# EasyEDA Pro project imu.eprj

# Schematic Schematic
Board Name: Board1; Create Date: 2025-12-13; Page Name: main; Project Name: imu; Schematic Name: Schematic; Update Date: 2025-12-13; Company: EasyEDA.com; Page Size: A4; Version: V1.0
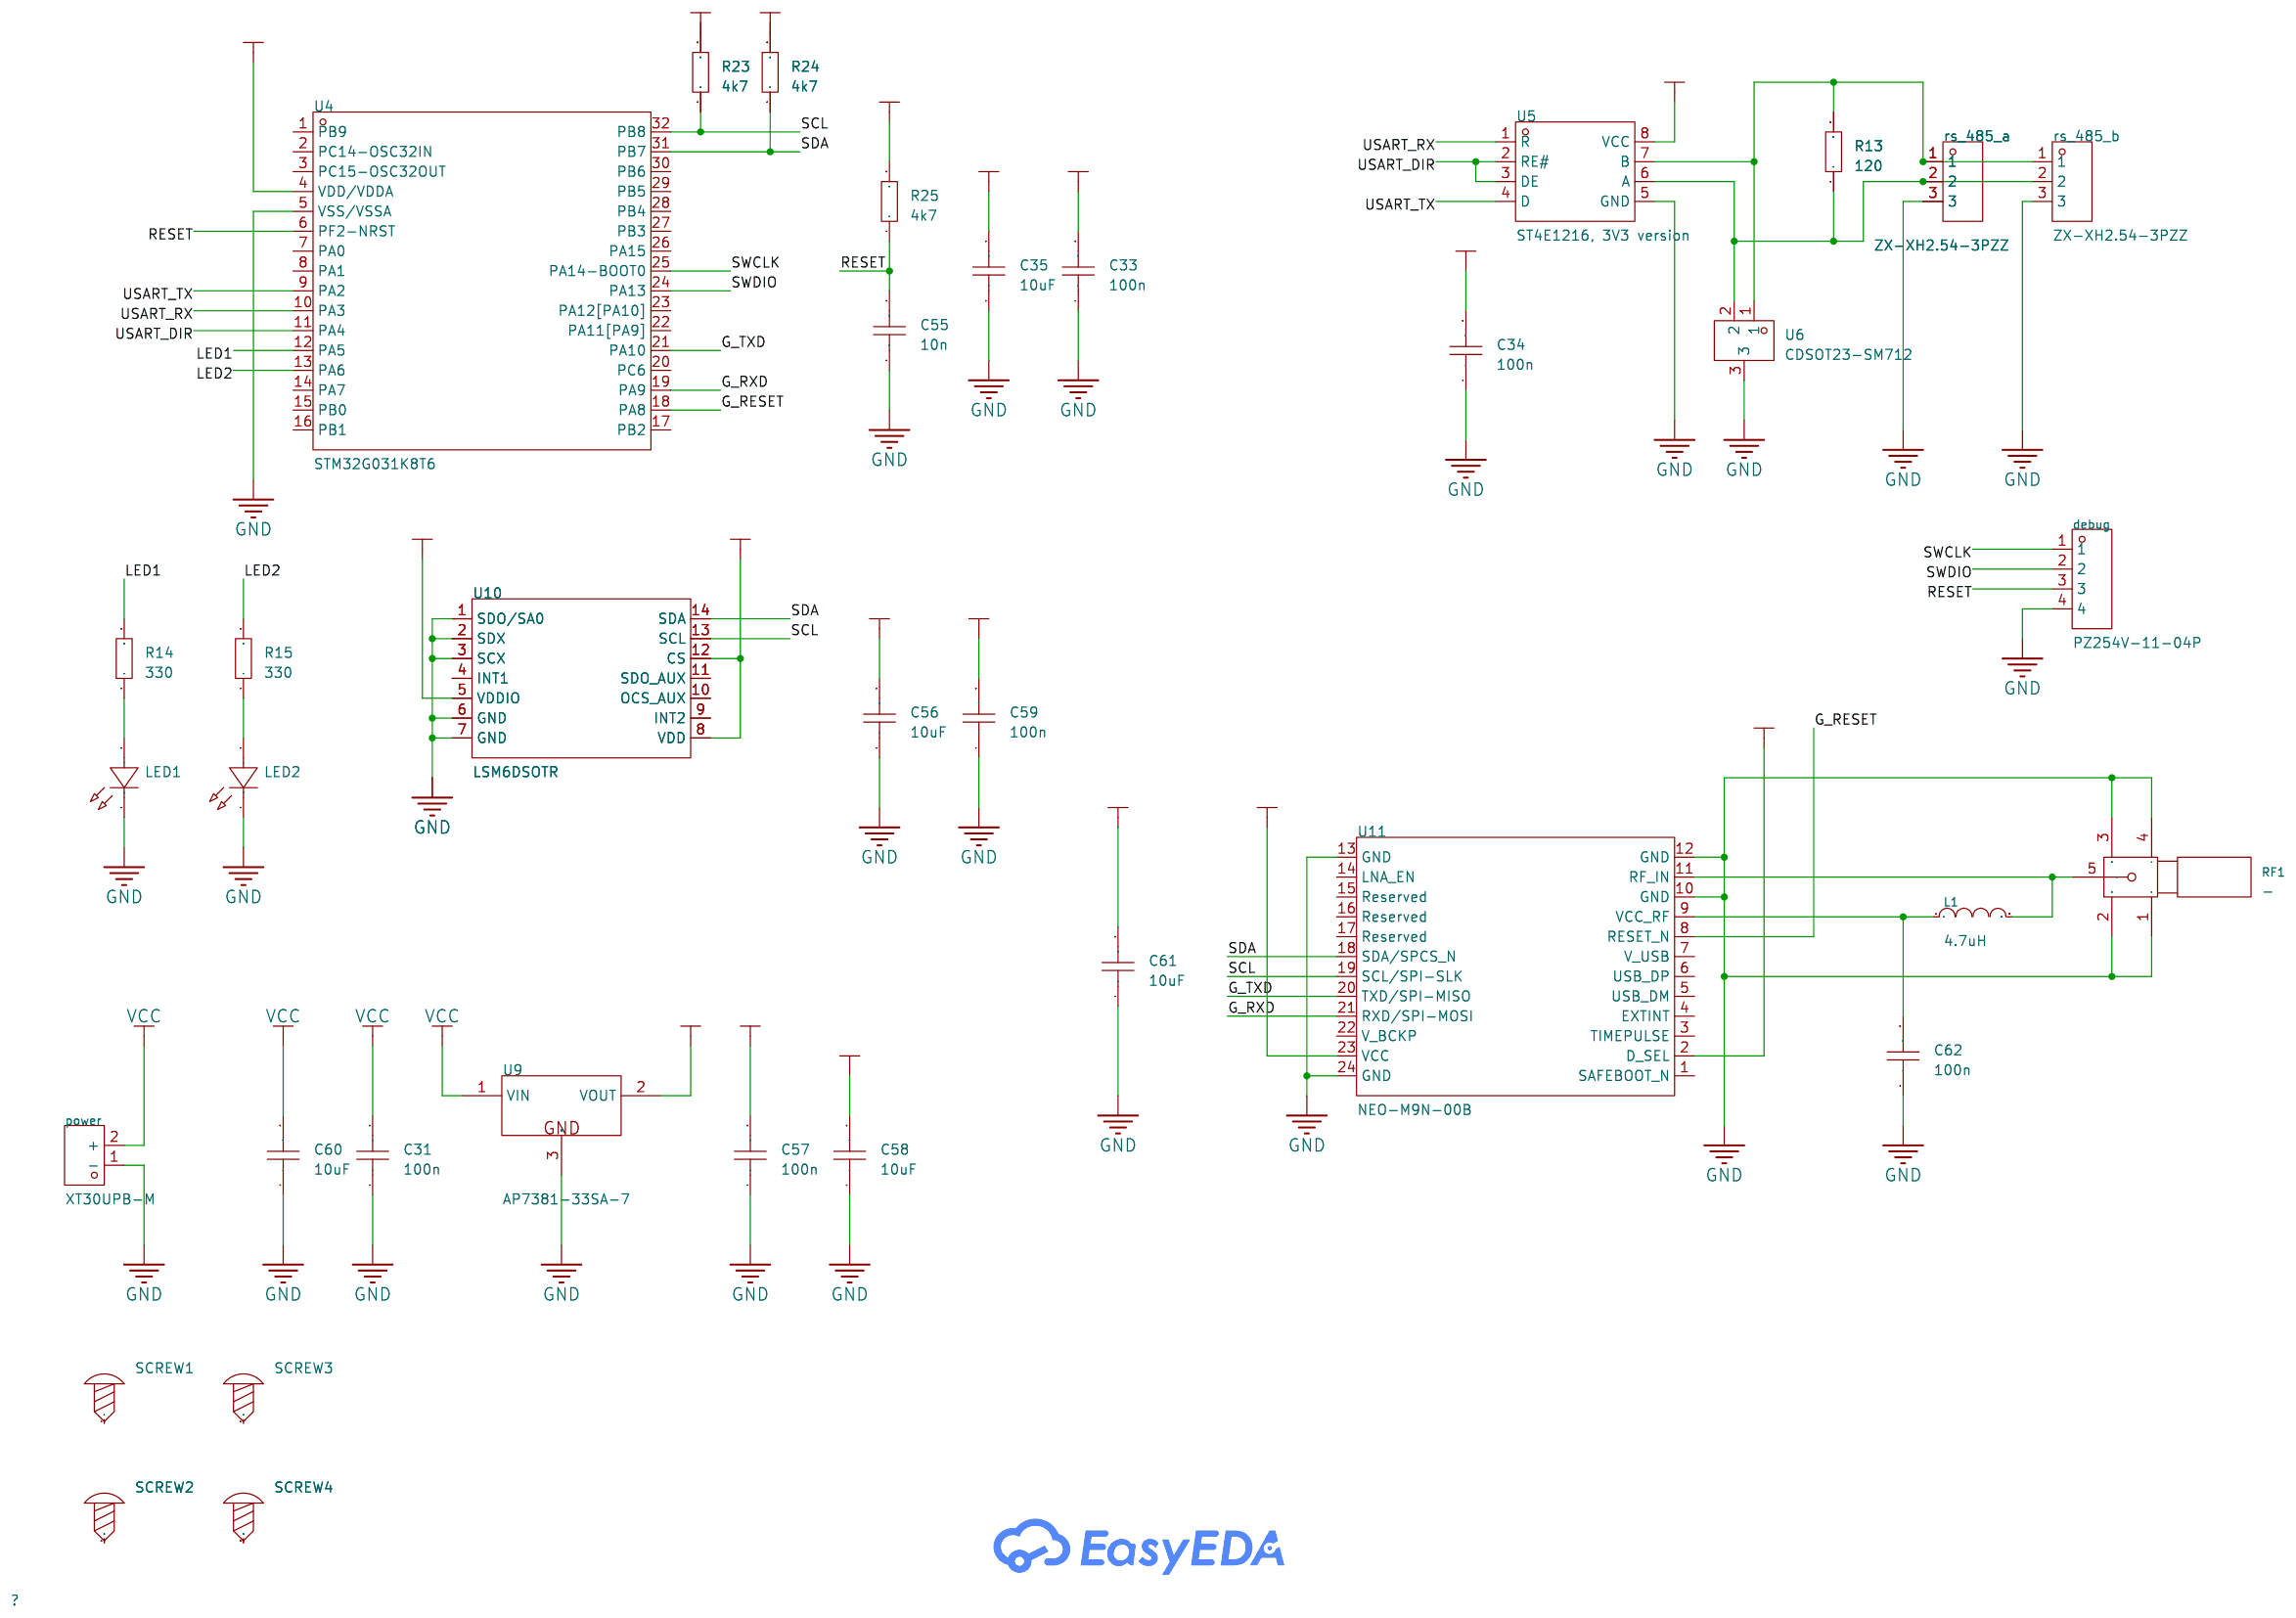
[diagram p0: schematic sheet]

## Parts
C31  10uF  [C0805]
C33  10uF  [C0805]
C34  10uF  [C0805]
C35  10uF  [C0805]
C55  10uF  [C0805]
C56  10uF  [C0805]
C57  10uF  [C0805]
C58  10uF  [C0805]
C59  10uF  [C0805]
C60  10uF  [C0805]
C61  10uF  [C0805]
C62  10uF  [C0805]
debug  PZ254V-11-04P  [HDR-TH_4P-P2.54-V-M]
L1  4.7uH  [L0805]
LED1  P2-1206RTCS2-0.9T-F  [LED-SMD_L3.2-W1.6-P2-1206RTCS2-0.9T-F]
LED2  P2-1206RTCS2-0.9T-F  [LED-SMD_L3.2-W1.6-P2-1206RTCS2-0.9T-F]
power  XT30UPB-M  [CONN-TH_XT30UPB-M]
R13  10kΩ  [R0805]
R14  10kΩ  [R0805]
R15  10kΩ  [R0805]
R23  10kΩ  [R0805]
R24  10kΩ  [R0805]
R25  10kΩ  [R0805]
RF1  -  [SMA-TH_BWSMA-KWE-Z001]
rs_485_a  ZX-XH2.54-3PZZ  [CONN-TH_3P-P2.54_2501S-3P]
rs_485_b  ZX-XH2.54-3PZZ  [CONN-TH_3P-P2.54_2501S-3P]
SCREW1  -  [Screw-Hole-M3]
SCREW2  -  [Screw-Hole-M3]
SCREW3  -  [Screw-Hole-M3]
SCREW4  -  [Screw-Hole-M3]
U4  STM32G031K8T6  [LQFP-32_L7.0-W7.0-P0.80-LS9.0-BL]
U5  ST4E1216, 3V3 version  [NSOIC-8_L4.9-W3.9-P1.27-LS6.1-BL]
U6  CDSOT23-SM712  [SOT-23-3_L2.9-W1.3-P0.95-LS2.4-BR]
U9  AP7381-33SA-7  [SOT-23-3_L2.9-W1.3-P1.90-LS2.4-BR]
U10  LSM6DSOTR  [LGA-14_L3.0-W2.5-P0.50-TL]
U11  NEO-M9N-00B  [GPSM-SMD_24P-L16.0-W12.2-P1.10-BL]

## Library data of the parts
C31 C33-C35 C55-C62 = CL21A106KAYNNNE_C15850: Capacitance:10uF Tolerance:±10% Tolerance:±10% Voltage Rating:25V Temperature Coefficient:X5R; LCSC Part Name: 10uF ±10% 25V; Supplier Part: C15850; Manufacturer: SAMSUNG(三星); Manufacturer Part: CL21A106KAYNNNE; Supplier Footprint: 0805; JLCPCB Part Class: Basic Part; Datasheet: https://item.szlcsc.com/datasheet/CL21A106KAYNNNE/16532.html; Supplier: LCSC; Tolerance: ±10%; Voltage Rating: 25V; Temperature Coefficient: X5R
debug = PZ254V-11-04P: Pin Structure:1x4P Pitch:2.54mm Row Spacing:- Circluar Pins/Square Pins:Pin Header Mounting Type:Through Hole Number of Rows:1 Number of Pins:4P Current Rating:3A Voltage Rating (Max):250V Length of Mating Pin:6mm Insulation Height:2.5mm Length of End Con; LCSC Part Name: 1x4P 间距:2.54mm 方针 直插; Supplier Part: C2691448; Manufacturer: XFCN(兴飞); Supplier Footprint: 插件,P=2.54mm; JLCPCB Part Class: Extended Part; Datasheet: https://item.szlcsc.com/datasheet/PZ254V-11-04P/2801085.html; Supplier: LCSC; Pin Structure: 1x4P; Pitch: 2.54mm; Circluar Pins/Square Pins: Pin Header; Mounting Type: Through Hole; Number of Rows: 1; Number of Pins: 4P; Current Rating: 3A; Voltage Rating (Max): 250V; Length of Mating Pin: 6mm; Insulation Height: 2.5mm; Length of End Connection Pin: 3mm; Operating Temperature: -40℃~+105℃; Color: Black
L1 = LQM21PN4R7MGRD: LCSC Part Name: 4.7uH ±20%; Supplier Part: C86090; Manufacturer: muRata(村田); Supplier Footprint: 0805; JLCPCB Part Class: Extended Part; Datasheet: https://item.szlcsc.com/datasheet/LQM21PN4R7MGRD/87266.html; Supplier: LCSC; Tolerance: ±20%; Current Rating: 800mA; DC Resistance(DCR): 288mΩ; Frequency - Self Resonant: 30MHz
LED1 LED2 = P2-1206RTCS2-0.9T-F: Illumination Color:Red Voltage - Forward(Vf):1.8V~2.4V Voltage - Forward(Vf):1.8V~2.4V Power(Watts):60mW Forward Current:20mA Wavelength - Dominant:618nm~625nm Wavelength - Dominant:618nm~625nm Peak Wavelength:630nm Diode Configuration:- Lens Color:Water; LCSC Part Name: 红灯 反贴; Supplier Part: C2827254; Manufacturer: TUOZHAN(拓展光电); Supplier Footprint: 1206; JLCPCB Part Class: Extended Part; Datasheet: https://item.szlcsc.com/datasheet/P2-1206RTCS2-0.9T-F/2972467.html; Supplier: LCSC; Illumination Color: Red; Voltage - Forward(Vf): 1.8V~2.4V; Power(Watts): 60mW; Forward Current: 20mA; Wavelength - Dominant: 618nm~625nm; Peak Wavelength: 630nm; Lens Color: Water Clear; Luminous Intensity: 250mcd; Viewing Angle: 120°; Mounting Style: Reverse Mount; Operating Temperature: -40℃~+85℃
power = XT30UPB-M: LCSC Part Name: AMASS(艾迈斯)板载立式 航模锂电池控制器连接器插头 公头XT30UPB-M; Supplier Part: C428721; Manufacturer: AMASS(艾迈斯); JLCPCB Part Class: Extended Part; Datasheet: https://item.szlcsc.com/datasheet/XT30UPB-M/423831.html; Supplier: LCSC; Type: Aviation model plug; Colour: Yellow; RatedVoltage: DC 500V; InterfaceType: Male; MetalMaterial: Gold Plated; InsulationMaterial: PA; RatedCurrent: 15A; contact resistance: 0.65mΩ
R13-R15 R23-R25 = 0805W8F1002T5E: Type:Thick Film Resistor Resistance:10kΩ Tolerance:±1% Tolerance:±1% Power(Watts):125mW Voltage-Supply(Max):150V Temperature Coefficient:±100ppm/℃ Temperature Coefficient:±100ppm/℃ Operating Temperature:-55℃~+155℃ Operating Temperature:-55℃~+155℃; LCSC Part Name: 10kΩ ±1% 125mW 厚膜电阻; Supplier Part: C17414; Manufacturer: UNI-ROYAL(厚声); Supplier Footprint: 0805; JLCPCB Part Class: Basic Part; Datasheet: https://item.szlcsc.com/datasheet/0805W8F1002T5E/18102.html; Supplier: LCSC; Type: Thick Film Resistor; Tolerance: ±1%; Power(Watts): 125mW; Voltage-Supply(Max): 150V; Temperature Coefficient: ±100ppm/℃; Operating Temperature: -55℃~+155℃
RF1 = BWSMA-KWE-Z001: LCSC Part Name: 内孔 SMA 弯头; Supplier Part: C496551; Manufacturer: BAT WIRELESS(蝙蝠无线); Supplier Footprint: 插件; JLCPCB Part Class: Extended Part; Datasheet: https://item.szlcsc.com/datasheet/BWSMA-KWE-Z001/508500.html; Supplier: LCSC; Connector Type: Board Side; Interface: Inner Bore; Number of Ports: 1; Interface Diameter: 5.3mm; RF Series: SMA; Impedance: 50Ω; Style: Elbow
rs_485_a rs_485_b = ZX-XH2.54-3PZZ: Pins Structure:1x3P Pitch:2.5mm Mounting Type:Through Hole Reference Series:XH Number of Pins:3P Number of Rows:1 Number of PINs Per Row:3 Row Spacing:- Current Rating:3A Contact Material:Brass Contact Plating:Tin Operating Temperature:-25℃~+85℃ Operating; LCSC Part Name: 1x3P 间距:2.5mm 直插 系列:XH; Supplier Part: C7429633; Manufacturer: Megastar(兆星); Supplier Footprint: 插件,P=2.5mm; JLCPCB Part Class: Extended Part; Datasheet: https://item.szlcsc.com/datasheet/ZX-XH2.54-3PZZ/8427550.html; Supplier: LCSC; Pins Structure: 1x3P; Pitch: 2.5mm; Mounting Type: Through Hole; Reference Series: XH; Number of Pins: 3P; Number of Rows: 1; Number of PINs Per Row: 3; Current Rating: 3A; Contact Material: Brass; Contact Plating: Tin; Operating Temperature: -25℃~+85℃; Voltage Rating: 250V; Plastic Material: PA66; Flame Retardant Rating: UL94V-0; Color: White; Z-Height of the Board: 7mm; X-Length of Bottom Edge on Board (Spacing Line): 10mm; Y-Width of Bottom Edge on Board: 5.9mm
SCREW1-SCREW4 = Screw-Hole-M3: Supplier Footprint: 插件
U4 = STM32G031K8T6: CPU Core:ARM Cortex-M Series CPU Maximum Speed:64MHz Program Storage Size:64KB Program Memory Type:FLASH Number of I/O:30 ADC (Bit):12bit Voltage - Supply:1.7V~3.6V Voltage - Supply:1.7V~3.6V Applications:-; LCSC Part Name: 主流Arm Cortex-M0+ MCU，具有64 KB Flash存储器、8 KB RAM、64 MHz CPU、2x USART、定时器、ADC和通信接口，1.7-3.6V; Supplier Part: C432203; Manufacturer: ST(意法半导体); Supplier Footprint: LQFP-32(7x7); JLCPCB Part Class: Extended Part; Datasheet: https://item.szlcsc.com/datasheet/STM32G031K8T6/428991.html; Supplier: LCSC; CPU Core: ARM Cortex-M Series; CPU Maximum Speed: 64MHz; Program Storage Size: 64KB; Program Memory Type: FLASH; Number of I/O: 30; ADC (Bit): 12bit; Voltage - Supply: 1.7V~3.6V
U5 = THVD1510DR: Type:Transceiver Number of Drivers:1 Number of Receivers:1 Voltage - Supply:4.5V~5.5V Voltage - Supply:4.5V~5.5V Data Rate:500Kbps Data Rate:500Kbps Number of Nodes:256 ESD Protect:±30kV ESD Protect:±30kV Operating Temperature:-40℃~+125℃ Operating Tempera; LCSC Part Name: THVD15xx 5-V RS-485 收发器，带有±18-kV IEC ESD 保护; Supplier Part: C191012; Manufacturer: TI(德州仪器); Supplier Footprint: SOIC-8; JLCPCB Part Class: Extended Part; Datasheet: https://www.ti.com/cn/lit/gpn/thvd1510; Supplier: LCSC; Type: Transceiver; Number of Drivers: 1; Number of Receivers: 1; Voltage - Supply: 4.5V~5.5V; Data Rate: 500Kbps; Number of Nodes: 256; ESD Protect: ±30kV; Operating Temperature: -40℃~+125℃; Communication Mode: Half-Duplex
U6 = CDSOT23-SM712: Polarity:Bidirectional Reverse Stand-Off Voltage (Vrwm):12V；7V Clamping Voltage:12V；26V Peak Pulse Current (Ipp):17A Peak Pulse Power Dissipation (Ppp):400W Voltage - Breakdown:7.5V；13.3V Reverse Leakage Current (Ir):50nA；2uA Number of Channels:2 Operatin; Supplier Part: C5122012; Manufacturer: TECH PUBLIC(台舟); Supplier Footprint: SOT-23; JLCPCB Part Class: Extended Part; Datasheet: https://item.szlcsc.com/datasheet/CDSOT23-SM712/5710598.html; Supplier: LCSC; Polarity: Bidirectional; Reverse Stand-Off Voltage (Vrwm): 12V；7V; Clamping Voltage: 12V；26V; Peak Pulse Current (Ipp): 17A; Peak Pulse Power Dissipation (Ppp): 400W; Voltage - Breakdown: 7.5V；13.3V; Reverse Leakage Current (Ir): 50nA；2uA; Number of Channels: 2; Operating Temperature: -55℃~+125℃; level of protection: IEC 61000-4-2；IEC 61000-4-4；IEC 61000-4-5; Type: ESD
U9 = AP7381-33SA-7: Output Type:Fixed Voltage - Supply:40V Output Voltage:3.3V Output Voltage:3.3V Output Current:150mA Power Supply Rejection Ratio (PSRR):60dB Voltage Dropout:1V@(100mA) standby current:2.5uA Features:Thermal Shutdown；Short Circuit Protection Operating Temp; LCSC Part Name: 输入40V 输出3.3V 150mA; Supplier Part: C3752764; Manufacturer: DIODES(美台); Supplier Footprint: SOT-23; JLCPCB Part Class: Extended Part; Datasheet: https://item.szlcsc.com/datasheet/AP7381-33SA-7/4320291.html; Supplier: LCSC; Output Type: Fixed; Voltage - Supply: 40V; Output Voltage: 3.3V; Output Current: 150mA; Power Supply Rejection Ratio (PSRR): 60dB; Voltage Dropout: 1V@(100mA); standby current: 2.5uA; Features: Thermal Shutdown；Short Circuit Protection; Operating Temperature: -40℃~+125℃@(Tj); Output Configuration: Positive; Number of Outputs: 1
U10 = LSM6DSOTR: Supplier Part: C2655100; Manufacturer: ST(意法半导体); Supplier Footprint: LGA-14(2.5x3); JLCPCB Part Class: Extended Part; Datasheet: https://item.szlcsc.com/datasheet/LSM6DSOTR/2747009.html; Supplier: LCSC; Accelerometer Sensing Axis: X,Y,Z; Acceleration Measurement Range (MAX): ±16g; Gyroscope Sensing Axis: X,Y,Z; Gyroscope Measurement Range (MAX): ±2000dps; Sensor Type: Accelerometer Gyroscope; Interface: I2C；SPI; Voltage - Supply: 1.71V~3.6V; Cache Size: 9KB; Operating Temperature: -40℃~+85℃
U11 = NEO-M9N-00B: LCSC Part Name: 标准精度GNSS模块; Supplier Part: C5119087; Manufacturer: U-BLOX; Supplier Footprint: SMD-24P; JLCPCB Part Class: Extended Part; Datasheet: https://item.szlcsc.com/datasheet/NEO-M9N-00B/5699013.html; Supplier: LCSC

## Nets
+3V3: C33.2 C34.2 C35.2 C56.2 C57.2 C58.2 C59.2 C61.2 R23.2 R24.2 R25.2 U4.4(VDD/VDDA) U5.8(VCC) U9.2(VOUT) U10.5(VDDIO) U10.8(VDD) U10.12(CS) U11.2(D_SEL) U11.23(VCC)
GND: C31.1 C33.1 C34.1 C35.1 C55.1 C56.1 C57.1 C58.1 C59.1 C60.1 C61.1 C62.1 debug.4 LED1.1(C) LED2.1(C) power.1(-) RF1.1 RF1.2 RF1.3 RF1.4 rs_485_a.3 rs_485_b.3 U4.5(VSS/VSSA) U5.5(GND) U6.3 U9.3(GND) U10.1(SDO/SA0) U10.2(SDX) U10.3(SCX) U10.6(GND) U10.7(GND) U11.10(GND) U11.12(GND) U11.13(GND) U11.24(GND)
VCC: C31.2 C60.2 power.2(+) U9.1(VIN)
G_RESET: U4.18(PA8) U11.8(RESET_N)
G_RXD: U4.19(PA9) U11.21(RXD/SPI-MOSI)
G_TXD: U4.21(PA10) U11.20(TXD/SPI-MISO)
LED1: R14.2 U4.12(PA5)
LED2: R15.2 U4.13(PA6)
RESET: C55.2 debug.3 R25.1 U4.6(PF2-NRST)
SCL: R23.1 U4.32(PB8) U10.13(SCL) U11.19(SCL/SPI-SLK)
SDA: R24.1 U4.31(PB7) U10.14(SDA) U11.18(SDA/SPCS_N)
SWCLK: debug.1 U4.25(PA14-BOOT0)
SWDIO: debug.2 U4.24(PA13)
USART_DIR: U4.11(PA4) U5.2(RE#) U5.3(DE)
USART_RX: U4.10(PA3) U5.1(R)
USART_TX: U4.9(PA2) U5.4(D)
$1N2122: R13.1 rs_485_a.2 rs_485_b.2 U5.6(A) U6.2
$1N2123: R13.2 rs_485_a.1 rs_485_b.1 U5.7(B) U6.1
$1N2138: LED1.2(A) R14.1
$1N2142: LED2.2(A) R15.1
$1N3587: L1.2 RF1.5 U11.11(RF_IN)
$1N3963: C62.2 L1.1 U11.9(VCC_RF)

Not connected (* = marked no-connect by the designer): SCREW1 1; SCREW2 1; SCREW3 1; SCREW4 1; U4 1(PB9) 2(PC14-OSC32IN) 3(PC15-OSC32OUT) 7(PA0) 8(PA1) 14(PA7) 15(PB0) 16(PB1) 17(PB2) 20(PC6) 22(PA11[PA9]) 23(PA12[PA10]) 26(PA15) 27(PB3) 28(PB4) 29(PB5) 30(PB6); U10 4(INT1) 9(INT2) 10(OCS_AUX) 11(SDO_AUX); U11 1(SAFEBOOT_N) 3(TIMEPULSE) 4(EXTINT) 5(USB_DM) 6(USB_DP) 7(V_USB) 14(LNA_EN) 15(Reserved) 16(Reserved) 17(Reserved) 22(V_BCKP)

# Board PCB1
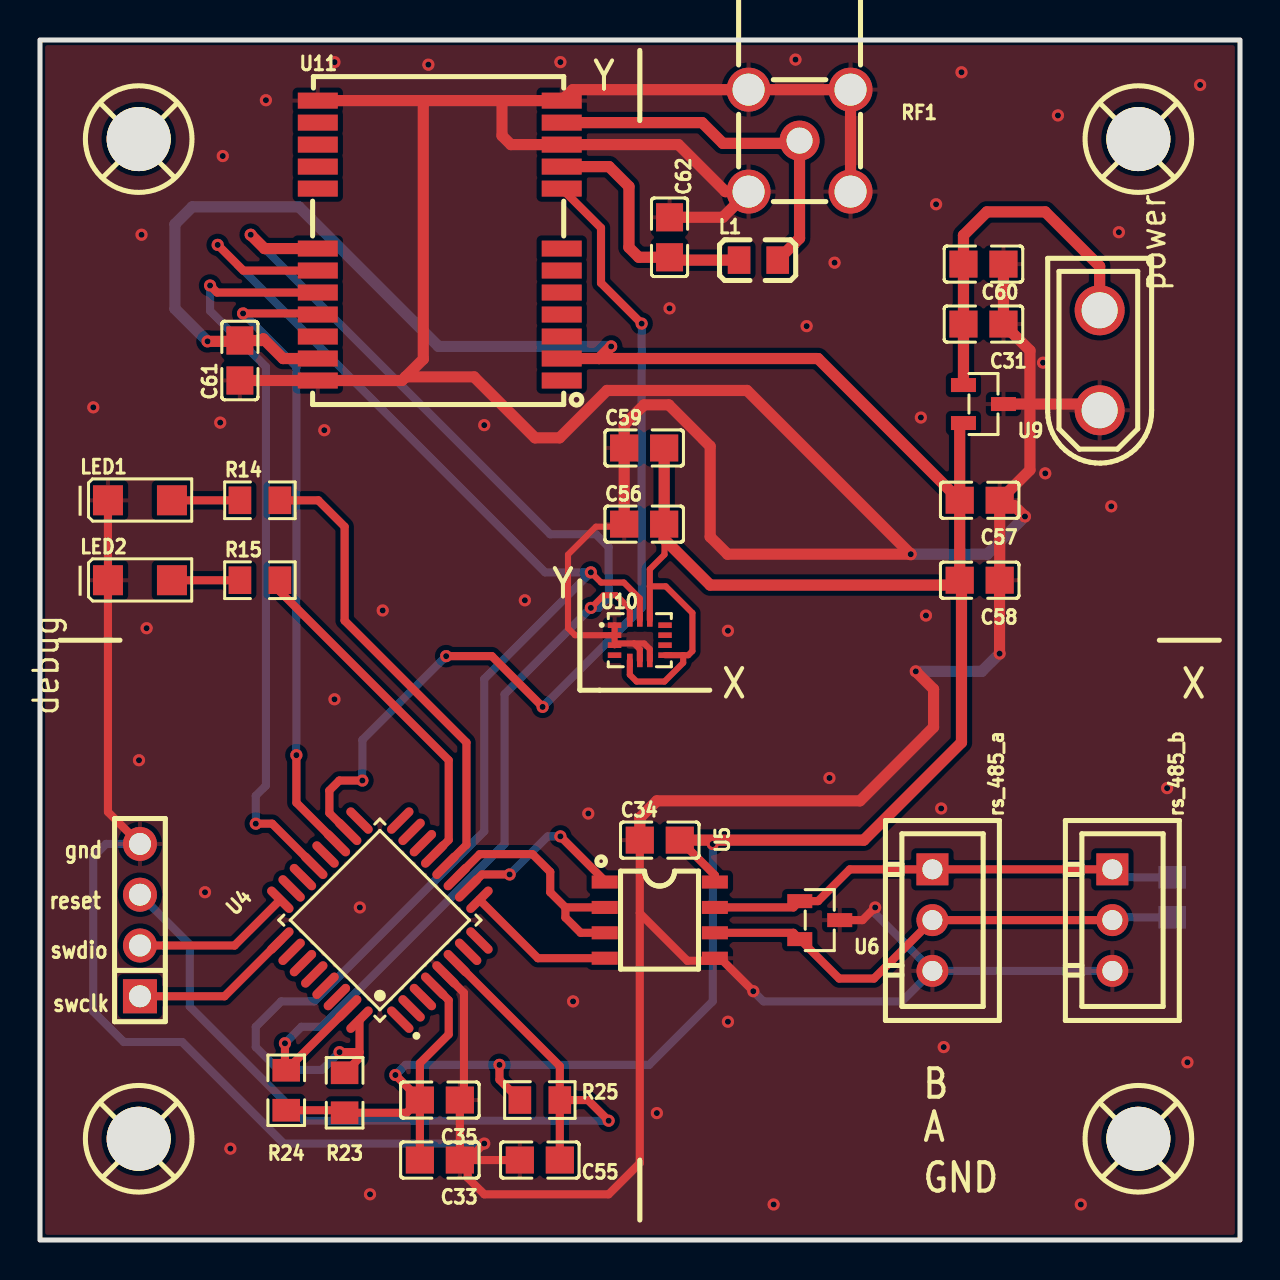
[diagram p1: board, top side]
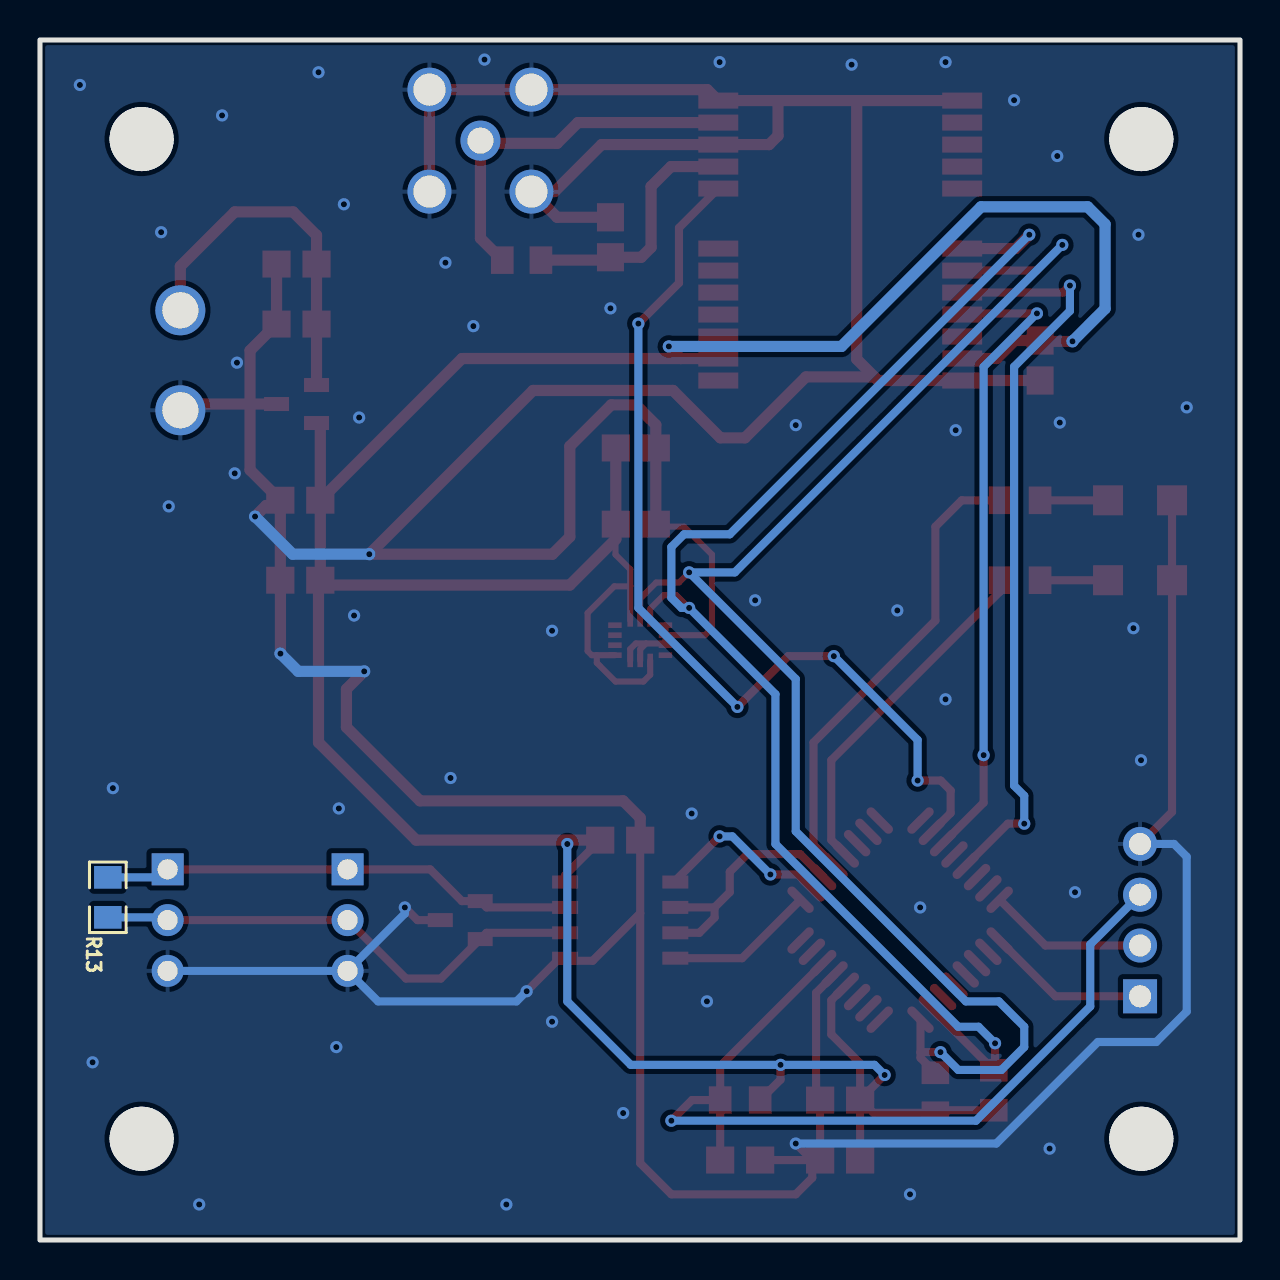
[diagram p2: board, bottom side, seen from below]

Outline 60.02 x 60.02 mm; copper layers: Top Layer, Bottom Layer. Coordinates in mm from the lower left corner of the outline.
Outline path: rectangle 0,60.02 60.02,0
Stack: Top Layer 0.035mm / Dielectric1 1.51mm FR4 er 4.5 / Bottom Layer 0.035mm

## Design rules (mm)
template: JLCPCB Capability(Two Layers Board)
spacing copperThickness1oz (default): track to track 0.102, other pairs 0.152 to 0.3
spacing copperThickness2oz: track to track 0.203, other pairs 0.152 to 0.3
track width copperThickness1oz (default): min 0.127, default 0.254, max 2.54
track width copperThickness2oz: min 0.203, default 0.254, max 2.54
differential pair differentialPair (default): width min 0.127, default 0.254, max 2.54; gap min 0.152, default 0.152
via viaSize (default): diameter min 0.5, default 0.61, max 10; hole min 0.3, default 0.305, max 6.3

## Placement (name value [footprint] x y rotation side)
C31  10uF  [C0805]  47.19 45.81 180 top
C33  10uF  [C0805]  20 4 180 top
C34  10uF  [C0805]  31 20 0 top
C35  10uF  [C0805]  20 7 180 top
C55  10uF  [C0805]  25 4 0 top
C56  10uF  [C0805]  30.22 35.81 0 top
C57  10uF  [C0805]  47 37 180 top
C58  10uF  [C0805]  47 33 180 top
C59  10uF  [C0805]  30.22 39.61 0 top
C60  10uF  [C0805]  47.19 48.81 180 top
C61  10uF  [C0805]  10 43.99 90 top
C62  10uF  [C0805]  31.49 50.15 270 top
debug  PZ254V-11-04P  [HDR-TH_4P-P2.54-V-M]  5 16 90 top
L1  4.7uH  [L0805]  35.93 49.01 0 top
LED1  P2-1206RTCS2-0.9T-F  [LED-SMD_L3.2-W1.6-P2-1206RTCS2-0.9T-F]  5 37 0 top
LED2  P2-1206RTCS2-0.9T-F  [LED-SMD_L3.2-W1.6-P2-1206RTCS2-0.9T-F]  5 33 0 top
power  XT30UPB-M  [CONN-TH_XT30UPB-M]  53 44 90 top
R13  10kΩ  [R0805]  56.63 17.14 90 bottom
R14  10kΩ  [R0805]  11 37 0 top
R15  10kΩ  [R0805]  11 33 0 top
R23  10kΩ  [R0805]  15.24 7.36 270 top
R24  10kΩ  [R0805]  12.32 7.49 270 top
R25  10kΩ  [R0805]  25 7 180 top
RF1  -  [SMA-TH_BWSMA-KWE-Z001]  37.99 54.99 90 top
rs_485_a  ZX-XH2.54-3PZZ  [CONN-TH_3P-P2.54_2501S-3P]  44.63 16 270 top
rs_485_b  ZX-XH2.54-3PZZ  [CONN-TH_3P-P2.54_2501S-3P]  53.63 16 270 top
SCREW1  -  [Screw-Hole-M3]  5 5 0 top
SCREW2  -  [Screw-Hole-M3]  55 5 0 top
SCREW3  -  [Screw-Hole-M3]  5 55 0 top
SCREW4  -  [Screw-Hole-M3]  55 55 0 top
U4  STM32G031K8T6  [LQFP-32_L7.0-W7.0-P0.80-LS9.0-BL]  17 16 45 top
U5  ST4E1216, 3V3 version  [NSOIC-8_L4.9-W3.9-P1.27-LS6.1-BL]  31 16 270 top
U6  CDSOT23-SM712  [SOT-23-3_L2.9-W1.3-P0.95-LS2.4-BR]  39 16 180 top
U9  AP7381-33SA-7  [SOT-23-3_L2.9-W1.3-P1.90-LS2.4-BR]  47.19 41.81 180 top
U10  LSM6DSOTR  [LGA-14_L3.0-W2.5-P0.50-TL]  30 30 0 top
U11  NEO-M9N-00B  [GPSM-SMD_24P-L16.0-W12.2-P1.10-BL]  20 49.99 0 top

## Footprints (pads in the part's own frame, mm; a bottom-side part is the same pattern mirrored in y, then rotated)
C0805
  rect 1.41x1.35 smd: 1(-1,0) 2(1,0)
CONN-TH_3P-P2.54_2501S-3P
  rect 1.6x1.6 hole 1: 1(-2.54,0)
  round 1.6 hole 1: 2(0,0) 3(2.54,0)
CONN-TH_XT30UPB-M
  round 2.5 hole 1.8: 1(-2.5,0) 2(2.5,0)
GPSM-SMD_24P-L16.0-W12.2-P1.10-BL
  rect 2x0.8 smd: 1(6.1,-7) 2(6.1,-5.9) 3(6.1,-4.8) 4(6.1,-3.7) 5(6.1,-2.6) 6(6.1,-1.5) 7(6.1,-0.4) 8(6.1,2.6) 9(6.1,3.7) 10(6.1,4.8) 11(6.1,5.9) 12(6.1,7) 13(-6.1,7) 14(-6.1,5.9) 15(-6.1,4.8) 16(-6.1,3.7) 17(-6.1,2.6) 18(-6.1,-0.4) 19(-6.1,-1.5) 20(-6.1,-2.6) 21(-6.1,-3.7) 22(-6.1,-4.8) 23(-6.1,-5.9) 24(-6.1,-7)
HDR-TH_4P-P2.54-V-M
  rect 1.7x1.7 hole 1.1: 1(-3.81,0)
  round 1.7 hole 1.1: 2(-1.27,0) 3(1.27,0) 4(3.81,0)
L0805
  rect 1.133x1.377 smd: 1(-0.966,0) 2(0.966,0)
LED-SMD_L3.2-W1.6-P2-1206RTCS2-0.9T-F
  rect 1.5x1.5 smd: 1(-1.6,0) 2(1.6,0)
LGA-14_L3.0-W2.5-P0.50-TL
  rect 0.675x0.28 smd: 1(-1.262,0.75) 2(-1.262,0.25) 3(-1.262,-0.25) 4(-1.262,-0.75) 8(1.262,-0.75) 9(1.262,-0.25) 10(1.262,0.25) 11(1.262,0.75)
  rect 0.28x0.675 smd: 5(-0.5,-1.012) 6(0,-1.012) 7(0.5,-1.012) 12(0.5,1.012) 13(0,1.012) 14(-0.5,1.012)
LQFP-32_L7.0-W7.0-P0.80-LS9.0-BL
  oval 0.448x1.684 smd: 1(-2.8,-4.242) 2(-2,-4.242) 3(-1.2,-4.242) 4(-0.4,-4.242) 5(0.4,-4.242) 6(1.2,-4.242) 7(2,-4.242) 8(2.8,-4.242) 17(2.8,4.242) 18(2,4.242) 19(1.2,4.242) 20(0.4,4.242) 21(-0.4,4.242) 22(-1.2,4.242) 23(-2,4.242) 24(-2.8,4.242)
  oval 1.684x0.448 smd: 9(4.242,-2.8) 10(4.242,-2) 11(4.242,-1.2) 12(4.242,-0.4) 13(4.242,0.4) 14(4.242,1.2) 15(4.242,2) 16(4.242,2.8) 25(-4.242,2.8) 26(-4.242,2) 27(-4.242,1.2) 28(-4.242,0.4) 29(-4.242,-0.4) 30(-4.242,-1.2) 31(-4.242,-2) 32(-4.242,-2.8)
NSOIC-8_L4.9-W3.9-P1.27-LS6.1-BL
  rect 0.65x1.3 smd: 1(-1.905,-2.756) 2(-0.635,-2.756) 3(0.635,-2.756) 4(1.905,-2.756) 5(1.905,2.756) 6(0.635,2.756) 7(-0.635,2.756) 8(-1.905,2.756)
R0805
  rect 1.133x1.377 smd: 1(-1,0) 2(1,0)
Screw-Hole-M3
  round 3.2 hole 3.2: 1(-0.064,0.064)
SMA-TH_BWSMA-KWE-Z001
  round 2.2 hole 1.6: 1(-2.55,-2.55) 2(-2.55,2.55) 3(2.55,2.55) 4(2.55,-2.55)
  round 2 hole 1.3: 5(0,0)
SOT-23-3_L2.9-W1.3-P0.95-LS2.4-BR
  rect 1.25x0.7 smd: 1(1,-0.95) 2(1,0.95) 3(-1,0)
SOT-23-3_L2.9-W1.3-P1.90-LS2.4-BR
  rect 1.25x0.7 smd: 1(1,-0.95) 2(1,0.95) 3(-1,0)

## Nets
As in the schematic.

Pads without a net: SCREW1 1; SCREW2 1; SCREW3 1; SCREW4 1; U4 1 2 3 7 8 14 15 16 17 20 22 23 26 27 28 29 30; U10 4 9 10 11; U11 1 3 4 5 6 7 14 15 16 17 22

## Via types
v1: diameter 0.61, hole 0.305, Top Layer to Bottom Layer, 74 vias

## Routing (per net, layer and track width the routed paths; a pad name or vN(x,y) marks a point on that pad's centre or on a via; arc(x,y) is an arc through that point)
+3V3: length 177.5
  Top Layer w0.305: 30.5,32.69 31.3,32.69 32.63,31.36 32.63,29.46 32.42,29.25 32.17,29.25 ; 30.5,32.69 30.5,33.55 31.23,34.28 31.23,35.04 ; 30.5,32.69 U10.12 ; U10.8 32.17,29.25 ; 32.17,29.25 32.17,28.87 31.23,27.93 29.84,27.93 29.5,28.27 U10.5
  Top Layer w0.406: U4.4 20.44,11.99 20.44,10.28 19,8.84 19,7.03 ; C34.2 33.76,18.24 U5.8 ; 19,7.03 C35.2 C33.2 ; 19,7.03 v1(17.78,8.25) ; 19,7.03 18.34,6.36 R23.2 15.11,6.49 R24.2 ; v1(22.98,8.76) 22.98,8.02 R25.2
  Top Layer w0.559: U9.2 46,40.67 C57.2 ; 46,33.21 C57.2 ; 46,33.21 45.55,32.76 33.52,32.76 31.23,35.04 31.22,35.06 C56.2 C59.2 ; 46,33.21 C58.2 ; 46,33.21 46.09,33.12 46.09,24.89 41.2,20 C34.2 ; C57.2 38.91,44.09 27.96,44.09 ; U11.2 27.96,44.09 ; 27.96,44.09 v1(28.57,44.69) ; v1(8.38,44.95) 9.96,44.95 C61.2 11.09,44.99 11.17,45.07 12.16,44.09 U11.23
  Bottom Layer w0.406: v1(17.78,8.25) 18.28,8.76 v1(22.98,8.76) 30.47,8.76 33.65,11.94 v1(33.65,19.81)
  Bottom Layer w0.559: v1(8.38,44.95) 6.75,46.58 6.75,50.81 7.62,51.68 12.95,51.68 19.93,44.69 v1(28.57,44.69)
GND: length 327.8
  Top Layer w0.305: U10.2 26.76,30.25 26.41,30.6 26.41,34.28 27.81,35.68 29.09,35.68 C56.1 ; U10.2 U10.1 ; U10.2 U10.3 28.83,29.84 29.71,29.84 ; 29.71,29.84 30.22,29.84 30.5,29.56 U10.7 ; 29.71,29.84 30,29.55 U10.6
  Top Layer w0.406: LED1.1 LED2.1 3.4,21.41 debug.4 ; v1(35.68,12.44) 34.15,13.97 33.63,13.97 ; 21.39,4 21.39,3.11 22.22,2.29 28.44,2.29 30,3.84 30,16.34 ; 21.39,4 C33.1 C35.1 21.2,7.2 21.2,12.36 U4.5 ; 21.39,4 C55.1 ; 21.39,4 v1(22.22,4.82) ; 30,16.34 32.38,13.97 33.63,13.97 ; 30,16.34 C34.1 ; v1(41.77,16.63) 41.14,16 U6.3 ; 33.63,13.97 U5.5
  Top Layer w0.559: C58.1 48,33.4 ; 48,33.4 48,36.74 ; 48,33.4 47.99,33.4 v1(47.99,29.33) ; U9.3 49.51,41.81 ; 49.51,41.81 52.69,41.81 power.1 ; 49.51,41.81 49.51,38.51 C57.1 48,36.74 ; 49.51,41.81 49.51,44.49 C31.1 C60.1 ; 19.04,56.99 U11.13 ; 19.04,56.99 23.17,56.99 ; 19.04,56.99 19.17,56.85 19.17,44.06 18.28,43.17 ; 23.17,56.99 U11.12 26.64,57.54 RF1.3 RF1.4 RF1.1 ; 23.17,56.99 23.11,56.93 23.11,55.23 23.55,54.79 U11.10 31.93,54.79 34.28,52.44 RF1.2 34.16,51.15 C62.1 ; 18.28,43.17 21.71,43.17 24.76,40.12 25.99,40.12 28.36,42.49 35.36,42.49 v1(43.55,34.3) 34.39,34.3 33.52,35.17 33.52,39.7 31.45,41.77 30.22,41.77 29.22,40.77 C59.1 C56.1 ; 18.28,43.17 18.1,42.99 U11.24 ; 48,36.74 48.71,36.74 v1(49.26,36.19) ; 13.89,42.99 C61.1 ; v1(43.8,28.44) 44.69,27.55 44.69,25.65 41.01,21.97 30.85,21.97 30,21.11 C34.1
  Bottom Layer w0.406: v1(35.68,12.44) 36.19,11.94 43.11,11.94 44.63,13.46 ; v1(22.22,4.82) 12.19,4.82 7.11,9.9 4.19,9.9 2.67,11.43 2.67,19.17 3.3,19.81 debug.4 ; v1(41.77,16.63) 41.77,16.32 44.63,13.46 ; 44.63,13.46 53.63,13.46
  Bottom Layer w0.559: v1(47.99,29.33) 47.1,28.44 v1(43.8,28.44) ; v1(49.26,36.19) 47.38,34.3 v1(43.55,34.3)
  vias: v1(2.67,41.65) v1(4.95,24) v1(5.08,50.28) v1(5.33,30.6) v1(8.25,17.39) v1(9.01,40.88) v1(9.14,54.22) v1(9.52,4.57) v1(11.3,57.01) v1(14.22,40.5) v1(14.73,58.91) v1(14.73,27.04) v1(16,16.63) v1(16.51,2.29) v1(17.14,31.49) v1(19.43,58.79) v1(22.22,40.76) v1(24.25,32) v1(26.03,58.91) v1(26.66,11.94) v1(27.43,21.33) v1(30.85,6.35) v1(31.49,46.6) v1(34.41,30.47) v1(34.41,10.92) v1(36.69,1.78) v1(37.79,59.04) v1(38.34,45.71) v1(39.49,23.11) v1(39.74,48.88) v1(44.06,41.14) v1(44.31,31.23) v1(44.82,51.8) v1(45.07,21.58) v1(45.2,9.65) v1(46.09,58.41) v1(50.17,43.88) v1(50.28,38.34) v1(50.91,56.25) v1(52.06,1.78) v1(53.58,36.69) v1(53.96,50.41) v1(56.37,22.6) v1(57.39,8.89) v1(58.02,57.77)
VCC: length 18.1
  Top Layer w0.559: power.2 53,48.7 50.28,51.42 47.36,51.42 46.19,50.25 C60.2 C31.2 U9.1
G_RESET: length 47.8
  Top Layer w0.406: v1(25.14,26.66) 22.6,29.2 v1(20.31,29.2) ; 14.46,22.47 14.97,22.98 v1(16.12,22.98) ; U11.8 28.06,50.62 28.06,47.87 v1(30.09,45.84) ; 14.47,22.47 14.47,21.35 U4.18
  Bottom Layer w0.406: v1(16.12,22.98) 16.12,25.01 v1(20.31,29.2) ; v1(25.14,26.66) 30.09,31.61 v1(30.09,45.84)
G_RXD: length 32.2
  Top Layer w0.406: U11.21 13.84,46.34 v1(10.16,46.34) ; U4.19 12.82,21.87 v1(12.82,24.25)
  Bottom Layer w0.406: v1(10.16,46.34) 12.82,43.68 v1(12.82,24.25)
G_TXD: length 37.6
  Top Layer w0.406: U11.20 8.86,47.39 v1(8.51,47.74) ; U4.21 11.61,20.82 v1(10.79,20.82)
  Bottom Layer w0.406: v1(8.51,47.74) 8.51,46.47 11.3,43.68 11.3,22.73 10.79,22.22 v1(10.79,20.82)
LED1: length 23.7
  Top Layer w0.406: U4.12 21.33,19.77 21.33,24.89 15.24,30.98 15.24,35.68 13.92,37 R14.2
LED2: length 17.5
  Top Layer w0.406: U4.13 20.44,20.01 20.44,24 12,32.44 R15.2
RESET: length 44.8
  Top Layer w0.406: U4.6 26,8.7 R25.1 ; R25.1 27.41,7 v1(28.44,5.97) ; R25.1 C55.2
  Bottom Layer w0.406: v1(28.44,5.97) 13.2,5.97 7.49,11.68 7.49,14.78 debug.3
SCL: length 75.7
  Top Layer w0.305: v1(27.55,33.39) 28.06,32.88 29.2,32.88 30,32.09 U10.13
  Top Layer w0.406: U11.19 10.17,48.49 v1(8.89,49.77) ; 15.98,9.4 15.98,9.11 R23.1 ; 15.98,9.4 U4.32 ; 15.98,9.4 v1(14.98,9.4)
  Bottom Layer w0.406: v1(14.98,9.4) 14.09,8.51 11.94,8.51 10.79,9.65 10.79,10.67 12.06,11.94 13.71,11.94 22.22,20.44 22.22,28.06 v1(27.55,33.39) 25.27,33.39 v1(8.89,49.77)
SDA: length 69.2
  Top Layer w0.305: v1(27.55,31.61) 28.19,32.25 28.82,32.25 29.5,31.57 U10.14
  Top Layer w0.406: v1(12.25,9.84) 12.25,8.55 R24.1 15.41,11.59 U4.31
  Top Layer w0.559: U11.18 11.23,49.59 v1(10.54,50.28)
  Bottom Layer w0.406: v1(12.25,9.84) 13.08,10.67 14.09,10.67 23.24,19.81 23.24,27.3 v1(27.55,31.61) 27.93,31.61 28.44,32.12 28.44,34.66 27.81,35.3 25.52,35.3 v1(10.54,50.28)
SWCLK: length 8.2
  Top Layer w0.406: U4.25 9.23,12.19 debug.1
SWDIO: length 8
  Top Layer w0.406: debug.2 9.73,14.73 U4.24
USART_DIR: length 12.4
  Top Layer w0.406: 26.28,16.64 U5.2 ; 26.28,16.64 26.28,16.13 27.04,15.36 U5.3 ; 26.28,16.64 25.52,17.39 25.52,18.41 24.63,19.3 22,19.3 U4.11
USART_RX: length 8.9
  Top Layer w0.406: U5.1 28.24,17.97 v1(26.03,20.19) ; U4.10 22.11,18.28 v1(23.49,18.28)
  Bottom Layer w0.406: v1(23.49,18.28) 25.39,20.19 v1(26.03,20.19)
USART_TX: length 7.5
  Top Layer w0.406: U5.4 24.9,14.09 U4.9
$1N2122: length 25.1
  Top Layer w0.406: 53.63,16 44.63,16 41.71,13.08 39.97,13.08 U6.2 37.69,15.36 U5.6
  Bottom Layer w0.406: 53.63,16 53.78,16.14 R13.1
$1N2123: length 23.8
  Top Layer w0.406: U5.7 37.69,16.64 U6.1 38.92,16.95 40.5,18.54 44.63,18.54 rs_485_a.1 rs_485_b.1
  Bottom Layer w0.406: rs_485_b.1 54.03,18.14 R13.2
$1N2138: length 3.4
  Top Layer w0.406: LED1.2 R14.1
$1N2142: length 3.4
  Top Layer w0.406: LED2.2 R15.1
$1N3587: length 18.8
  Top Layer w0.559: U11.11 33.12,55.89 34.15,54.85 37.85,54.85 RF1.5 37.99,50.1 L1.2
$1N3963: length 12.6
  Top Layer w0.559: U11.9 28.46,53.69 29.46,52.69 29.46,49.64 29.95,49.15 C62.2 31.63,49.01 L1.1

## Copper pours and planes (outline as drawn; the poured copper is in the pictures)
GND on Top Layer: -2.03,61.83 68.94,61.83 68.94,-0.89 -2.03,-0.89
GND on Bottom Layer: -1.52,73.13 62.09,73.13 62.09,-1.78 -1.52,-1.78

## Text on the board
Top Silkscreen Layer: reset | swdio | swclk | gnd | Y | X | B | A | GND
